# EasyEDA schematic easyEDA.json
TITLE: Sheet_1; REV: 1.0; Date: 2025-06-25; Sheet: 1/1; Drawn By: cballevre; Company: Your Company
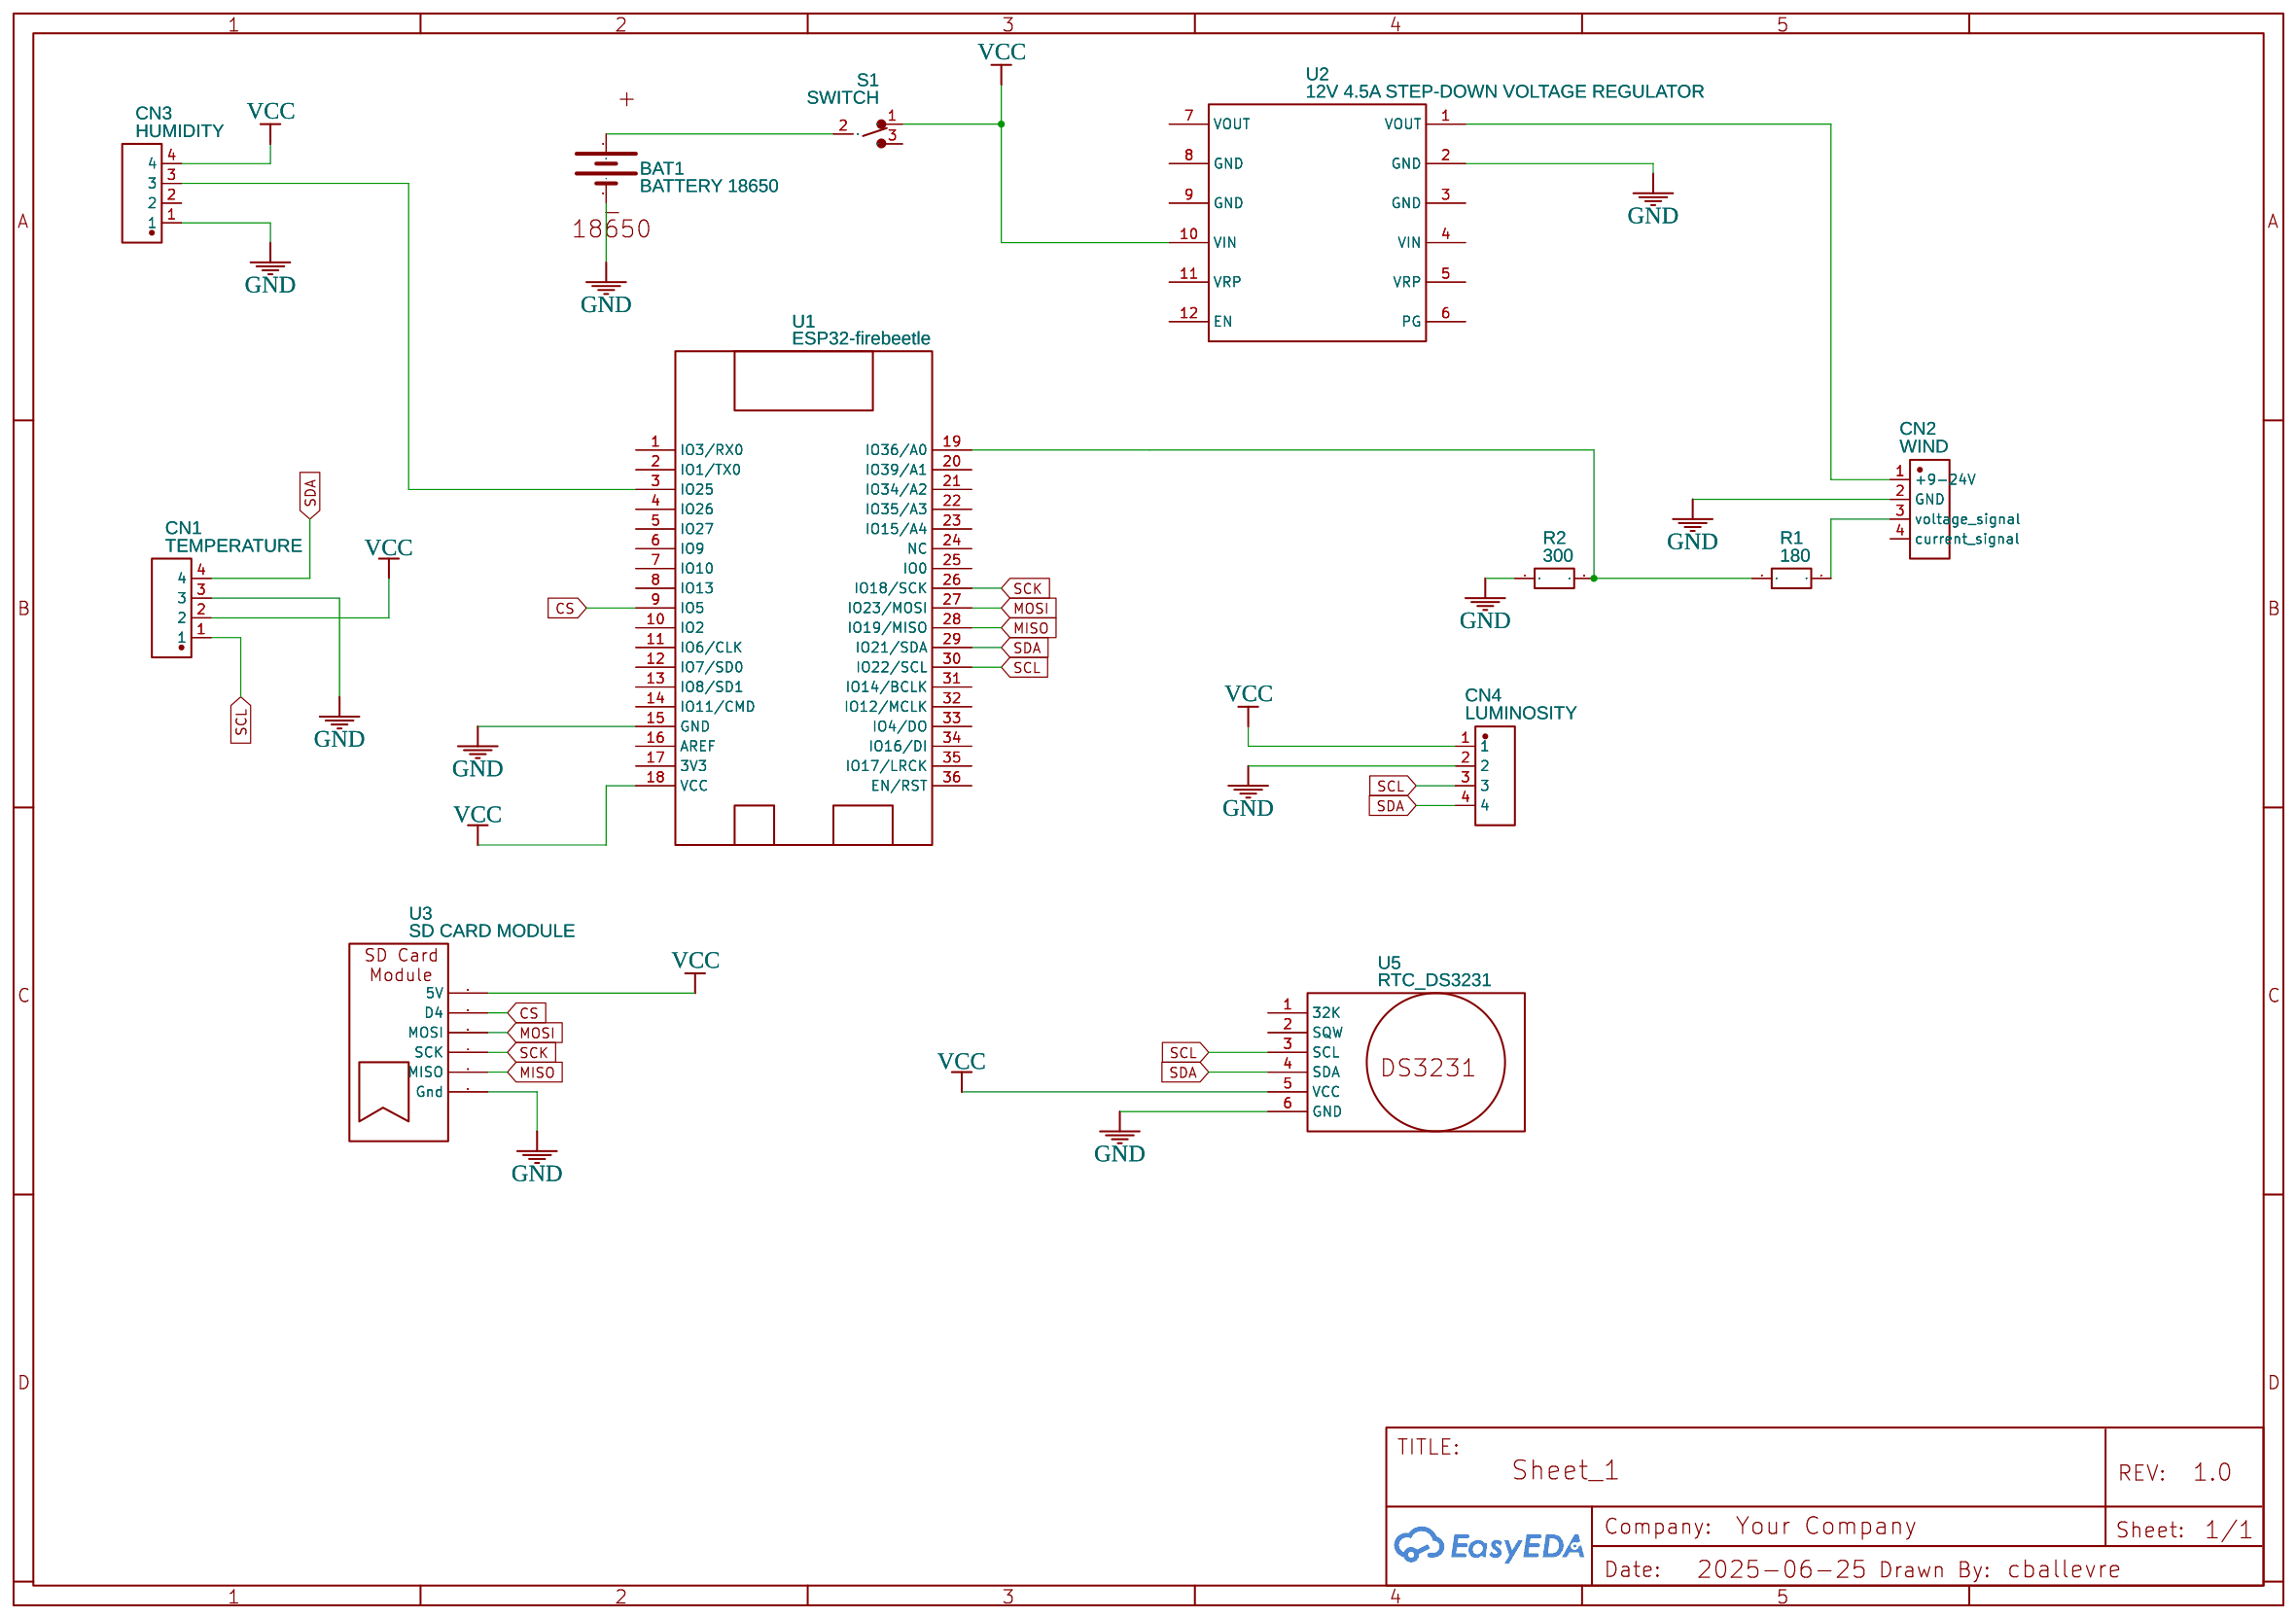
[diagram p0: schematic sheet]

## Parts
BAT1  BATTERY 18650  [ADAFRUIT 18650 BATTERY HOLDER KFLMIAMI420 BH-18650-PC-ND]
CN1  TEMPERATURE  [CONN-TH_4P-L14.5-W4.7-P2.20]
CN2  WIND  [CONN-TH_4P-L14.5-W4.7-P2.20]
CN3  HUMIDITY  [CONN-TH_4P-L14.5-W4.7-P2.20]
CN4  LUMINOSITY  [CONN-TH_4P-L14.5-W4.7-P2.20]
R1  180  [R0603]
R2  300  [R0603]
S1  SWITCH  [SWITCH-ESWITCH-SLIDE-TH-EG1218]
U1  ESP32-firebeetle  [ESP32 FIREBEETLE]
U2  12V 4.5A STEP-DOWN VOLTAGE REGULATOR  [D36V50F12]
U3  SD CARD MODULE  [SD CARD MODULE W/ SD CARD]
U5  RTC_DS3231  [DS3231]

## Library data of the parts
BAT1 = BATTERY 18650: Contributor: fsergiy; Manufacturer Part: battery
CN1-CN4 = STRAIGHT 4 PINS MAGNETIC CONNECTOR FEMALE: Supplier: LCSC; Supplier Part: C9900150561; Manufacturer: null; Manufacturer Part: Straight 4 pins magnetic connector Female; Contributor: lcsc
R1 R2 = R_0603_EU: Contributor: LCEDA_Lib
S1 = SWITCH-SLIDE-SPDT-200MA-30V: Contributor: gokmenim
U1 = ESP32-firebeetle: Contributor: lamaune
U2 = 12V 4.5A STEP-DOWN VOLTAGE REGULATOR: Contributor: carlo78
U3 = SD CARD MODULE COPY JEF: Manufacturer Part: sd card module; Contributor: p.c.abhemanyu
U5 = UhrModul_DS3231: Contributor: NIPUN GUPTA

## Nets
GND: BAT1.2(-) CN1.3 CN2.2(GND) CN3.1 CN4.2 R2.1 U1.15(GND) U2.2(GND) U3.1(Gnd) U5.6(GND)
VCC: CN1.2 CN3.4 CN4.1 S1.1 U1.18(VCC) U2.10(VIN) U3.6(5V) U5.5(VCC)
CS: U1.9(IO5) U3.5(D4)
MISO: U1.28(IO19/MISO) U3.2(MISO)
MOSI: U1.27(IO23/MOSI) U3.3(MOSI)
SCK: U1.26(IO18/SCK) U3.4(SCK)
SCL: CN1.1 CN4.3 U1.30(IO22/SCL) U5.3(SCL)
SDA: CN1.4 CN4.4 U1.29(IO21/SDA) U5.4(SDA)
Net-(BAT1-1): BAT1.1(+) S1.2
Net-(CN2-1): CN2.1(+9-24V) U2.1(VOUT)
Net-(CN2-3): CN2.3(voltage signal) R1.2
Net-(CN3-3): CN3.3 U1.3(IO25)
Net-(R1-1): R1.1 R2.2 U1.19(IO36/A0)

Not connected (* = marked no-connect by the designer): CN2 4(current signal); CN3 2; S1 3; U1 1(IO3/RX0) 2(IO1/TX0) 4(IO26) 5(IO27) 6(IO9) 7(IO10) 8(IO13) 10(IO2) 11(IO6/CLK) 12(IO7/SD0) 13(IO8/SD1) 14(IO11/CMD) 16(AREF) 17(3V3) 20(IO39/A1) 21(IO34/A2) 22(IO35/A3) 23(IO15/A4) 24(NC) 25(IO0) 31(IO14/BCLK) 32(IO12/MCLK) 33(IO4/DO) 34(IO16/DI) 35(IO17/LRCK) 36(EN/RST); U2 3(GND) 4(VIN) 5(VRP) 6(PG) 7(VOUT) 8(GND) 9(GND) 11(VRP) 12(EN); U5 1(32K) 2(SQW)
